# Altium schematic sheet WirlessSubSystem.SchDoc
size A4; Date: 27.05.2014; Author: AOM1; DrawnBy: AOM1; Organization: BFH; Address1: Berner Fachhochschule; Address2: Technik und Informatik; Address3: Jlcoweg 1; Address4: 3400 Burgdorf; DocumentNumber: 1; Revision: 1.0; SheetNumber: 5; SheetTotal: 6; CurrentDate: 27.05.2014
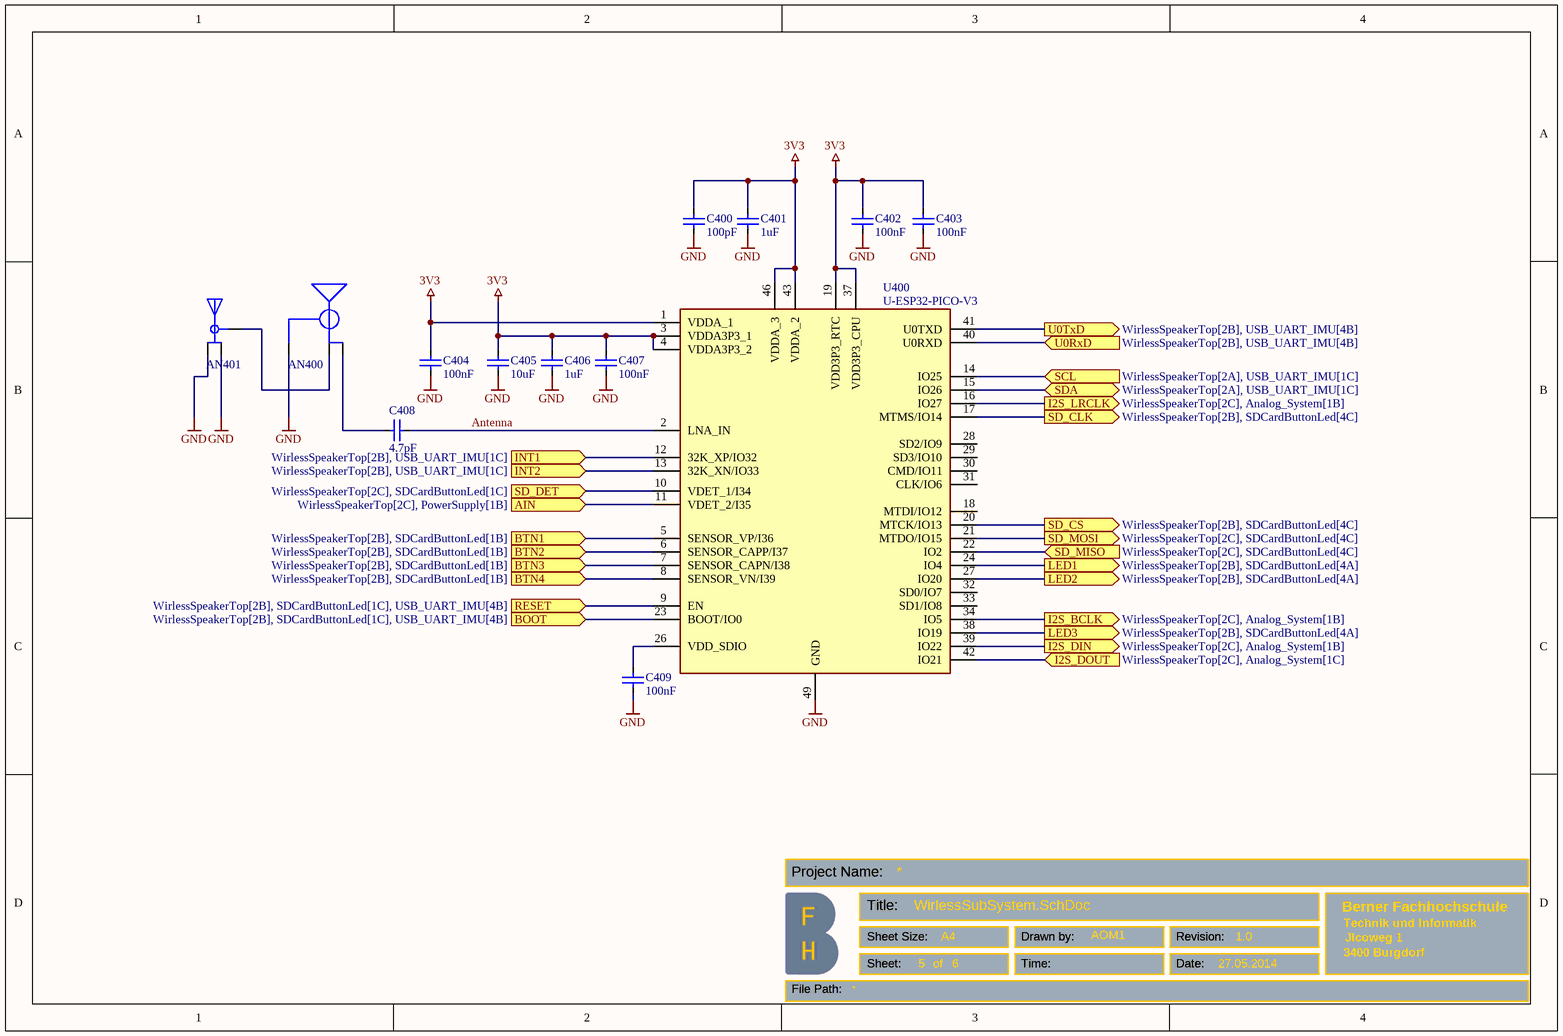
[diagram p0: WirlessSubSystem.SchDoc]

## Parts
AN400  PCB-Antenna  [ESP32-PCB-Antenna]  (value not drawn)
AN401  AN-U.FL-R-SMT-1(10)  [HRS_U.FL-R-SMT-1(10)]  (value not drawn)
C400  100pF  [C-0603]
C401  1uF  [C-0603]
C402  100nF  [C-0603]
C403  100nF  [C-0603]
C404  100nF  [C-0603]
C405  10uF  [C-0603]
C406  1uF  [C-0603]
C407  100nF  [C-0603]
C408  4.7pF  [C-0402]
C409  100nF  [C-0603]
U400  U-ESP32-PICO-V3  [ESP32PICOV3]

## Ports
AIN (in, see WirlessSpeakerTop[2C], PowerSupply[1B]), BOOT (in, see WirlessSpeakerTop[2B], SDCardButtonLed[1C], USB_UART_IMU[4B]), BTN1 (in, see WirlessSpeakerTop[2B], SDCardButtonLed[1B]), BTN2 (in, see WirlessSpeakerTop[2B], SDCardButtonLed[1B]), BTN3 (in, see WirlessSpeakerTop[2B], SDCardButtonLed[1B]), BTN4 (in, see WirlessSpeakerTop[2B], SDCardButtonLed[1B]), I2S_BCLK (out, see WirlessSpeakerTop[2C], Analog_System[1B]), I2S_DIN (out, see WirlessSpeakerTop[2C], Analog_System[1B]), I2S_DOUT (in, see WirlessSpeakerTop[2C], Analog_System[1C]), I2S_LRCLK (out, see WirlessSpeakerTop[2C], Analog_System[1B]), INT1 (in, see WirlessSpeakerTop[2B], USB_UART_IMU[1C]), INT2 (in, see WirlessSpeakerTop[2B], USB_UART_IMU[1C]), LED1 (out, see WirlessSpeakerTop[2B], SDCardButtonLed[4A]), LED2 (out, see WirlessSpeakerTop[2B], SDCardButtonLed[4A]), LED3 (out, see WirlessSpeakerTop[2B], SDCardButtonLed[4A]), RESET (in, see WirlessSpeakerTop[2B], SDCardButtonLed[1C], USB_UART_IMU[4B]), SCL (in, see WirlessSpeakerTop[2A], USB_UART_IMU[1C]), SD_CLK (out, see WirlessSpeakerTop[2B], SDCardButtonLed[4C]), SD_CS (out, see WirlessSpeakerTop[2B], SDCardButtonLed[4C]), SD_DET (in, see WirlessSpeakerTop[2C], SDCardButtonLed[1C]), SD_MISO (in, see WirlessSpeakerTop[2C], SDCardButtonLed[4C]), SD_MOSI (out, see WirlessSpeakerTop[2C], SDCardButtonLed[4C]), SDA (bidir, see WirlessSpeakerTop[2A], USB_UART_IMU[1C]), U0RxD (in, see WirlessSpeakerTop[2B], USB_UART_IMU[4B]), U0TxD (out, see WirlessSpeakerTop[2B], USB_UART_IMU[4B])

## Nets
3V3: C400.2 C401.2 C402.2 C403.2 C404.2 C405.2 C406.2 C407.2 U400.1(VDDA_1) U400.3(VDDA3P3_1) U400.4(VDDA3P3_2) U400.19(VDD3P3_RTC) U400.37(VDD3P3_CPU) U400.43(VDDA_2) U400.46(VDDA_3)
GND: AN400.GND AN401.1(GND) AN401.3(GND) C400.1 C401.1 C402.1 C403.1 C404.1 C405.1 C406.1 C407.1 C409.2 U400.49(GND)
AIN: U400.11(VDET_2/I35) ; port AIN
Antenna: C408.1 U400.2(LNA_IN)
BOOT: U400.23(BOOT/IO0) ; port BOOT
BTN1: U400.5(SENSOR_VP/I36) ; port BTN1
BTN2: U400.6(SENSOR_CAPP/I37) ; port BTN2
BTN3: U400.7(SENSOR_CAPN/I38) ; port BTN3
BTN4: U400.8(SENSOR_VN/I39) ; port BTN4
I2S_BCLK: U400.34(IO5) ; port I2S_BCLK
I2S_DIN: U400.39(IO22) ; port I2S_DIN
I2S_DOUT: U400.42(IO21) ; port I2S_DOUT
I2S_LRCLK: U400.16(IO27) ; port I2S_LRCLK
INT1: U400.12(32K_XP/IO32) ; port INT1
INT2: U400.13(32K_XN/IO33) ; port INT2
LED1: U400.24(IO4) ; port LED1
LED2: U400.27(IO20) ; port LED2
LED3: U400.38(IO19) ; port LED3
RESET: U400.9(EN) ; port RESET
SCL: U400.14(IO25) ; port SCL
SD_CLK: U400.17(MTMS/IO14) ; port SD_CLK
SD_CS: U400.20(MTCK/IO13) ; port SD_CS
SD_DET: U400.10(VDET_1/I34) ; port SD_DET
SD_MISO: U400.22(IO2) ; port SD_MISO
SD_MOSI: U400.21(MTDO/IO15) ; port SD_MOSI
SDA: U400.15(IO26) ; port SDA
U0RxD: U400.40(U0RXD) ; port U0RxD
U0TxD: U400.41(U0TXD) ; port U0TxD
NetAN400_ANT1: AN400.ANT1(ANT) C408.2
NetAN400_ANT2: AN400.ANT2(ANT) AN401.2(SIG)
NetC409_1: C409.1 U400.26(VDD_SDIO)

Not connected (* = marked no-connect by the designer): U400 18(MTDI/IO12) 28(SD2/IO9) 29(SD3/IO10) 30(CMD/IO11) 31(CLK/IO6) 32(SD0/IO7) 33(SD1/IO8)

## Notes on the sheet
- Project Name:
- Title:
- Sheet Size:
- Sheet:
- of
- A4
- Drawn by:
- Time:
- Revision:
- Date:
- File Path:

## Library data of the parts
AN400 = AN-ESP32-PCB-Antenna: PCB, 2.4 GHz Antenna; Manufacturer: BFH; Part-Number: PCB 2.4 GHz Antenna; Added: 28.08.2018; Price (CHF): 0.0; ComponentLink1Description: Antenna for ESP32; Order_Code: PCB 2.4 GHz Antenna
AN401 = AN-U.FL-R-SMT-1(10): U.FL _UMCC_ Connector Receptacle, Male Pin 50Ohm Surface Mount Solder; Manufacturer: Hirose; Order-Code: 798-U.FL-R-SMT-110; Mfr. Part No.: U.FL-R-SMT-1(10); SnapEDA_Link: https://www.snapeda.com/parts/U.FL-R-SMT-1%2810%29/Hirose%20Electric%20Co%20Ltd/view-part/55192/?ref=snap; Distributor: Mouser; Package: None; Value: *; Notice: *
C400-C407 C409 = C-SMD-0603: Multilayer Ceramic Capacitors MLCC; Manufacturer: Murata Electronics; Mfr. Part No.: GRM18...; Order-Code: 81-GRM18...; Price (CHF): 0.12; Distributor: Mouser; Added: 28.08.2018; ComponentLink1Description: Chip Multilayer Ceramic Capacitors; ComponentLink1URL: https://www.mouser.ch/datasheet/2/281/murata_03052018_GRM_Series_1-1310166.pdf; Notice: -; Mounting Style: SMD/SMT; Package: 0603
C408 = C-SMD-0402: Multilayer Ceramic Capacitors MLCC; Manufacturer: Murata Electronics; Mfr. Part No.: GRM02*; Order-Code: 81-GRM02...; Price (CHF): 0.12; Distributor: Mouser; Added: 28.08.2018; ComponentLink1Description: Chip Multilayer Ceramic Capacitors; ComponentLink1URL: https://www.mouser.ch/datasheet/2/281/murata_03052018_GRM_Series_1-1310166.pdf; Notice: -; Mounting Style: SMD/SMT; Package: 0402
U400 = U-ESP32-PICO-V3-BFH: RF System on a Chip; Manufacturer_Name: Espressif Systems; Manufacturer: Espressif; Mfr. Part No.: ESP32-PICO-V3-02; Mountig Style: SMD/SMT; Order-Code: 356-ESP32-PICO-V3-02; Datasheet Link: https://kr.mouser.com/datasheet/2/891/esp32-pico-v3_datasheet_en-1842685.pdf; Height: 1.04mm; Manufacturer_Part_Number: ESP32-PICO-V3; Mouser Part Number: 356-ESP32-PICO-V3; Mouser Price/Stock: https://www.mouser.co.uk/ProductDetail/Espressif-Systems/ESP32-PICO-V3?qs=GBLSl2Akirs311o8knsnZA%3D%3D; Added: 08.08.2021; Distributor: Mouser; Package: ESP32PICOV3; Notice: -; Price (CHF): 3.20